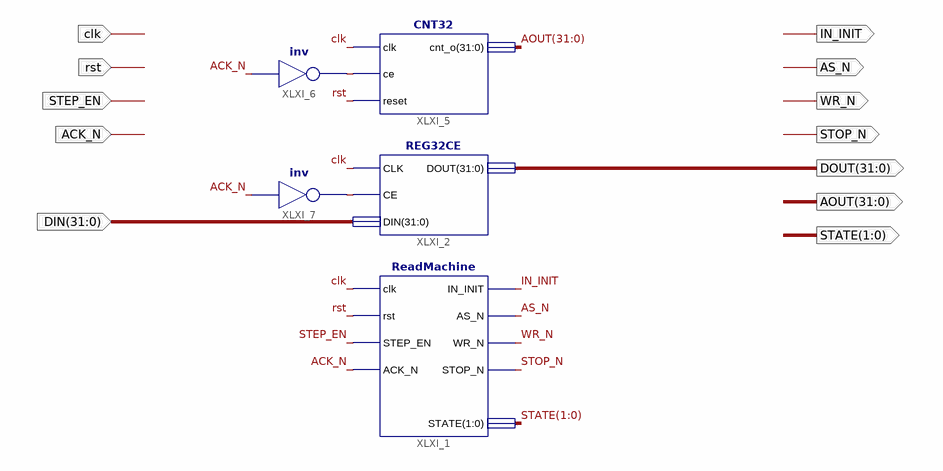
[diagram p0: schematic sheet 1]
// Xilinx ISE schematic ReadMachineSuite.sch (spartan6) as structural Verilog: 5 symbols, 12 ports
module ReadMachineSuite (
  input  clk,
  input  rst,
  input  STEP_EN,
  input  ACK_N,
  input  [31:0] DIN,
  output IN_INIT,
  output STOP_N,
  output [31:0] DOUT,
  output AS_N,
  output WR_N,
  output [1:0] STATE,
  output [31:0] AOUT
);

  wire XLXN_7, XLXN_10;

  ReadMachine XLXI_1 (
    .clk(clk), .rst(rst), .STEP_EN(STEP_EN), .ACK_N(ACK_N), .IN_INIT(IN_INIT), .AS_N(AS_N), .WR_N(WR_N),
    .STOP_N(STOP_N), .STATE(STATE));
  REG32CE XLXI_2 (.CLK(clk), .CE(XLXN_10), .DIN(DIN), .DOUT(DOUT));
  CNT32 XLXI_5 (.clk(clk), .ce(XLXN_7), .reset(rst), .cnt_o(AOUT));
  not XLXI_6 (XLXN_7, ACK_N);
  not XLXI_7 (XLXN_10, ACK_N);
endmodule
